# Altium schematic sheet I2C_EXPANDER.SchDoc: AI ARTIQ Driver
size 420 x 297 mm; Author: G.Kasprowicz; CompanyName: CTI; Organization: CTI; Address1: CTI; Address2: Nowowiejska 15/19 00-665 Warsaw; Address3: gkasprow@gmail.com; DocumentNumber: 8; Revision: 0.2; SheetNumber: 8; SheetTotal: 11; ModifiedBy: -; CheckedDate: -; Title2: I2C expander; DivGrp: CTI; ModifiedDate: -; ProjectName: Sensor Box
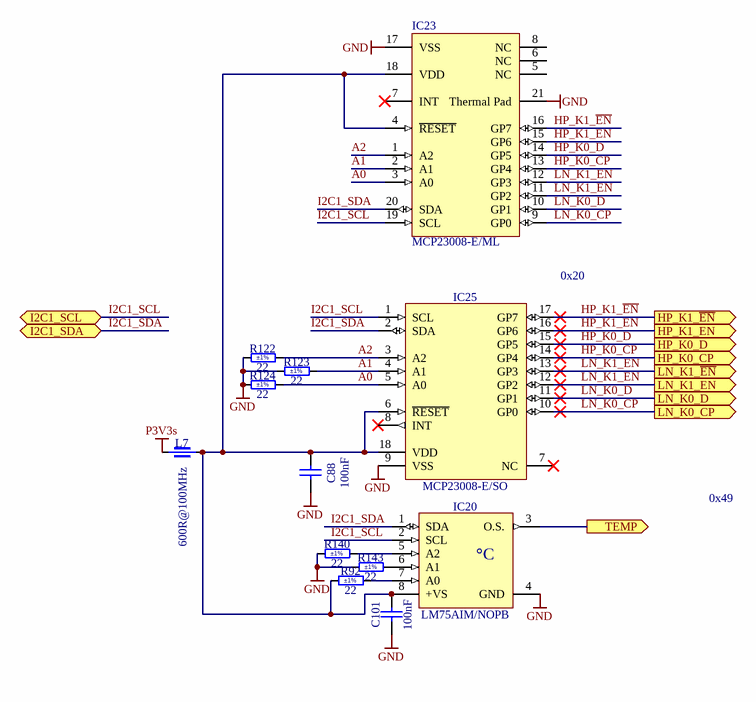
[diagram p0: I2C_EXPANDER.SchDoc]

## Parts
C88  100nF  [CAPC1608X87N]
C101  100nF  [CAPC1608X87N]
IC20  LM75AIM/NOPB  [SOIC127P600X175-8N]
IC23  MCP23008-E/ML  [QFN-ML20_M]
IC25  MCP23008-E/SO  [SOIC127P1030X265-18N]
L7  600R@100MHz  [INDC1608X95N]
R92  22  Tolerance: ±1%  [RESC1608X55N]
R122  22  Tolerance: ±1%  [RESC1608X55N]
R123  22  Tolerance: ±1%  [RESC1608X55N]
R124  22  Tolerance: ±1%  [RESC1608X55N]
R140  22  Tolerance: ±1%  [RESC1608X55N]
R143  22  Tolerance: ±1%  [RESC1608X55N]

## Ports
HP_K0_CP (out), HP_K0_D (out), HP_K1_EN (out), HP_K1_~{EN} (out), I2C1_SCL (bidir), I2C1_SDA (bidir), LN_K0_CP (out), LN_K0_D (out), LN_K1_EN (out), LN_K1_~{EN} (out), TEMP (out)

## Nets
GND: C88.1 C101.1 IC20.4(GND) IC23.17(VSS) IC23.21(Thermal_Pad) IC25.9(VSS) R122.1 R123.1 R124.1 R140.1 R143.1
P3V3s: L7.1
A0: IC23.3(A0) IC25.5(A0) R124.2
A1: IC23.2(A1) IC25.4(A1) R123.2
A2: IC23.1(A2) IC25.3(A2) R122.2
HP_K0_CP: IC23.13(GP4) IC25.14(GP4) ; port HP_K0_CP
HP_K0_D: IC23.14(GP5) IC25.15(GP5) ; port HP_K0_D
HP_K1_~{EN}: IC23.16(GP7) IC25.17(GP7) ; port HP_K1_~{EN}
HP_K1_EN: IC23.15(GP6) IC25.16(GP6) ; port HP_K1_EN
I2C1_SCL: IC20.2(SCL) IC23.19(SCL) IC25.1(SCL) ; port I2C1_SCL
I2C1_SDA: IC20.1(SDA) IC23.20(SDA) IC25.2(SDA) ; port I2C1_SDA
LN_K0_CP: IC23.9(GP0) IC25.10(GP0) ; port LN_K0_CP
LN_K0_D: IC23.10(GP1) IC25.11(GP1) ; port LN_K0_D
LN_K1_~{EN}: IC23.12(GP3) IC25.13(GP3) ; port LN_K1_~{EN}
LN_K1_EN: IC23.11(GP2) IC25.12(GP2) ; port LN_K1_EN
TEMP: IC20.3(O.S.) ; port TEMP
NetC88_2: C88.2 C101.2 IC20.8(+VS) IC23.4(~{RESET}) IC23.18(VDD) IC25.6(~{RESET}) IC25.18(VDD) L7.2 R92.1
NetIC20_5: IC20.5(A2) R140.2
NetIC20_6: IC20.6(A1) R143.2
NetIC20_7: IC20.7(A0) R92.2

Not connected (* = marked no-connect by the designer): IC23 5(NC) 6(NC) 7(INT)* 8(NC); IC25 7(NC)* 8(INT)*

## Notes on the sheet
- 0x20
- 0x49
- Project/Equipment
- Document
- Designer
- Drawn by
- Check.by
- Copyright Creotech Instruments SA 2014.
  This documentation describes Open Hardware and is licensed under the CERN OHL v.1.1. You may redistribute and modify this documentation under the terms of the CERN OHL v.1.1. (http://ohwr.org/CERNOHL). This documentation is distributed WITHOUT ANY EXPRESS OR IMPLIED WARRANTY, INCLUDING OF MERCHANTABILITY, SATISFACTORY QUALITY AND FITNESS FOR A PARTICULAR PURPOSE. Please see the CERN OHL v.1.1 for applicable conditions.
- File
- Last Mod.
- Print Date
- Sheet
- Size
- A3
- of
- Rev
- (in symbol LM75AIM/NOPB) °C

## Library data of the parts
C88 C101 = CC0603_100NF_50V_10%_X7R: Non-polarised capacitor; Part Description: SMD Multilayer Chip Ceramic Capacitor; Manufacturer: GENERIC; Manufacturer1 Part Number: 223858615649; Voltage: 50V; TC: X7R; Tolerance: ±10%; Part Number: CC0603_100NF_50V_10%_X7R; Component Kind: Standard; Component Type: Standard; Pin Count: 2; Value: 100nF; Status: Preferred; Manufacturer Part Number: CC0603_100NF_50V_10%_X7R; Case: 0603; Mounted: Yes; Socket: No; SMD: Yes; Sense: No; Manufacturer1 Example: PHYCOMP; Manufacturer1 ComponentHeight: 0.87mm; HelpURL: \\cern.ch\dfs\Applications\Altium\Datasheets\CC0603_X7R_PHYCOMP.pdf; Author: CERN DEM JLC; CreateDate: 03.12.2007; LatestRevisionDate: 03.12.2007
IC20 = LM75AIM/NOPB: Digital Temperature Sensor and Thermal Watchdog with Two-Wire Interface; Part Description: -25° to +100°C ±2°C Digital Temperature Sensor and Thermal Watchdog with Two-Wire Interface; Manufacturer: TEXAS INSTRUMENTS; PressFit: No; Bonding: No; Part Number: LM75AIM/NOPB; Component Kind: Standard; Component Type: Standard; Device: LM75AIM/NOPB; PackageDescription: SOIC 8, Pitch 1.27mm - Body 4x5mm, IPC Medium Density; Manufacturer Part Number: LM75AIM/NOPB; Pin Count: 8; Case: SOIC8; Mounted: Yes; Socket: No; SMD: Yes; Sense: No; ComponentHeight: 1.75mm; HelpURL: \\cern.ch\dfs\Applications\Altium\Datasheets\LM75AIM-NOPB.pdf; Author: CERN DEM JLC; CreateDate: 15.10.2012; LatestRevisionDate: 15.10.2012
IC23 = CMP-0186-00018-2: 8-Bit I/O Expander with Serial Interface, 20-Pin QFN, Extended Temperature; ComponentLink2URL: http://ww1.microchip.com/downloads/en/DeviceDoc/21919e.pdf; ComponentLink1Description: Manufacturer URL; ComponentLink3Description: Package Specification; ComponentLink1URL: http://www.microchip.com/; RevisionNote: URLs added.; PackageReference: QFN-ML20; ComponentLink2Description: Datasheet; PackageDescription: 20-Lead Plastic Quad Flat, No Lead Package (ML) - 4x4x0.9 mm Body [QFN]; ComponentLink3URL: http://www.microchip.com/stellent/groups/techpub_sg/documents/packagingspec/en012702.pdf; DatasheetVersion: revE, Aug-2007; PackageVersion: revBB, Aug-2009
IC25 = MCP23008-E/SO: 8-Bit I/O Expander with Serial Interface; Manufacturer: MICROCHIP TECHNOLOGY; PressFit: No; Bonding: No; Part Number: MCP23008-E/SO; Component Kind: Standard; Component Type: Standard; Device: MCP23008-E/SO; PackageDescription: SOIC, 18-Leads, Body 13.9x7.6mm (max), Pitch 1.27mm, IPC Medium Density; Part Description: 8-Bit I/O Expander with Serial Interface; Manufacturer Part Number: MCP23008-E/SO; Pin Count: 18; Case: SOIC18; Mounted: Yes; Socket: No; SMD: Yes; Sense: No; ComponentHeight: 2.65mm; Author: CERN DEM JLC; HelpURL: \\cern.ch\dfs\Applications\Altium\Datasheets\MCP23008-E-SO.pdf; CreateDate: 30.10.2012; LatestRevisionDate: 30.10.2012
L7 = IND0603_MURATA_BLM18AG601SN1: Part Description: SMD EMIFIL Suppression Chip Ferrite Bead; Manufacturer: MURATA; Power: 500mA; Resistance: 0.38R; Tolerance: ±25%; Part Number: IND0603_MURATA_BLM18AG601SN1; Component Kind: Standard; Component Type: Standard; Pin Count: 2; Value: 600R@100MHz; Status: None; Manufacturer Part Number: BLM18AG601SN1; Case: 0603; Mounted: Yes; Socket: No; SMD: Yes; Sense: No; ComponentHeight: 0.95mm; HelpURL: \\cern.ch\dfs\Applications\Altium\Datasheets\IND0603_MURATA_BLM18A.pdf; Author: CERN DEM MR; CreateDate: 01.04.2016; LatestRevisionDate: 25.10.2018
R92 R122-R124 R140 R143 = R0603_22R_1%_0.1W_100PPM: Resistor - 1%; Part Description: General Purpose Thick Film Chip Resistor; Manufacturer: GENERIC; Manufacturer1 Part Number: NRC06F22R0TRF; Power: 0.1W; TC: ±100ppm/°C; PressFit: No; Part Number: R0603_22R_1%_0.1W_100PPM; Component Kind: Standard; Component Type: Standard; Pin Count: 2; Value: 22; Status: Preferred; Manufacturer Part Number: R0603_22R_1%_0.1W_100PPM; Case: 0603; Mounted: Yes; Sense: No; Socket: No; SMD: Yes; Manufacturer1 Example: NIC COMPONENT; Manufacturer1 ComponentHeight: 0.55mm; HelpURL: \\cern.ch\dfs\Applications\Altium\Datasheets\R0603_NIC_NRC.pdf; Author: CERN DEM JLC; CreateDate: 03.12.2007; LatestRevisionDate: 13.03.2008